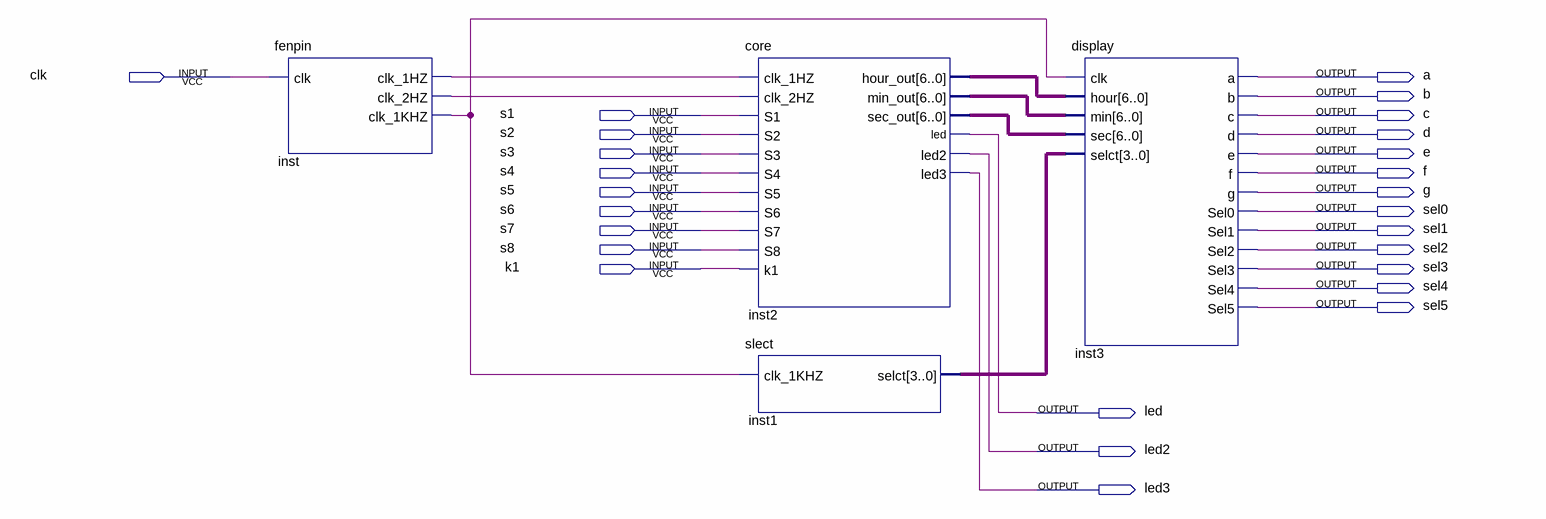
[diagram p0: schematic sheet]
// Quartus schematic sch.bdf as structural Verilog: 4 symbols, 26 pins
module sch (
  input  clk,
  input  s1,
  input  s2,
  input  s3,
  input  s4,
  input  s5,
  input  s6,
  input  s7,
  input  s8,
  input  k1,
  output a,
  output b,
  output c,
  output d,
  output e,
  output f,
  output g,
  output sel0,
  output sel1,
  output sel2,
  output sel3,
  output sel4,
  output sel5,
  output led,
  output led2,
  output led3
);

  wire inst_clk_1hz, inst_clk_1khz, inst_clk_2hz;
  wire [3:0] inst1_selct;
  wire [6:0] inst2_hour_out, inst2_min_out, inst2_sec_out;

  fenpin inst (.clk(clk), .clk_1HZ(inst_clk_1hz), .clk_2HZ(inst_clk_2hz), .clk_1KHZ(inst_clk_1khz));
  core inst2 (
    .clk_1HZ(inst_clk_1hz), .clk_2HZ(inst_clk_2hz), .S1(s1), .S2(s2), .S3(s3), .S4(s4), .S5(s5), .S6(s6),
    .S7(s7), .S8(s8), .k1(k1), .hour_out(inst2_hour_out), .min_out(inst2_min_out), .sec_out(inst2_sec_out),
    .led(led), .led2(led2), .led3(led3));
  slect inst1 (.clk_1KHZ(inst_clk_1khz), .selct(inst1_selct));
  display inst3 (
    .clk(inst_clk_1khz), .hour(inst2_hour_out), .min(inst2_min_out), .sec(inst2_sec_out),
    .selct(inst1_selct), .a(a), .b(b), .c(c), .d(d), .e(e), .f(f), .g(g), .Sel0(sel0), .Sel1(sel1),
    .Sel2(sel2), .Sel3(sel3), .Sel4(sel4), .Sel5(sel5));
endmodule
